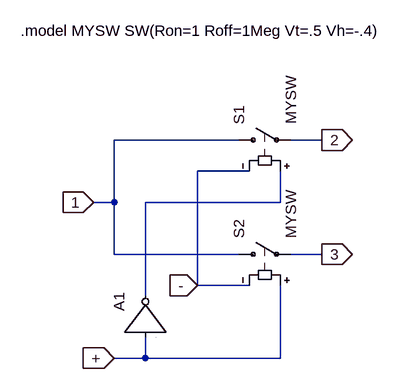
[diagram p0: schematic SPDT.asc]
SPDT.asc, the LTspice schematic file:
Version 4
SHEET 1 880 680
WIRE 192 32 0 32
WIRE 320 32 272 32
WIRE 208 80 128 80
WIRE 0 128 0 32
WIRE 0 128 -32 128
WIRE 256 128 256 80
WIRE 256 128 48 128
WIRE 0 208 0 128
WIRE 192 208 0 208
WIRE 320 208 272 208
WIRE 128 256 128 80
WIRE 208 256 128 256
WIRE 48 272 48 128
WIRE 48 368 48 336
WIRE 48 368 0 368
WIRE 256 368 256 256
WIRE 256 368 48 368
FLAG -32 128 1
IOPIN -32 128 In
FLAG 0 368 +
IOPIN 0 368 In
FLAG 128 256 -
IOPIN 128 256 In
FLAG 320 32 2
IOPIN 320 32 Out
FLAG 320 208 3
IOPIN 320 208 Out
SYMBOL sw 176 32 R270
SYMATTR InstName S1
SYMATTR Value MYSW
SYMBOL sw 176 208 R270
SYMATTR InstName S2
SYMATTR Value MYSW
SYMBOL Digital\\inv -16 336 R270
SYMATTR InstName A1
TEXT -144 -136 Left 2 !.model MYSW SW(Ron=1 Roff=1Meg Vt=.5 Vh=-.4)

The netlist it stands for:
* SPDT.asc
S1 1 2 N001 - MYSW
S2 1 3 + - MYSW
A1 + 0 0 0 0 N001 0 0 BUF
.model MYSW SW(Ron=1 Roff=1Meg Vt=.5 Vh=-.4)
.backanno
.end